# Altium schematic sheet BlockDiagram.SchDoc
size A3; ApprovedBy: Ahmet Can; DocumentNumber: 2; SheetNumber: 2; SheetTotal: 5; ENG_APP_DATE: --/--/--; DSN_APP_DATE: --/--/--; CHK_APP_DATE: --/--/--
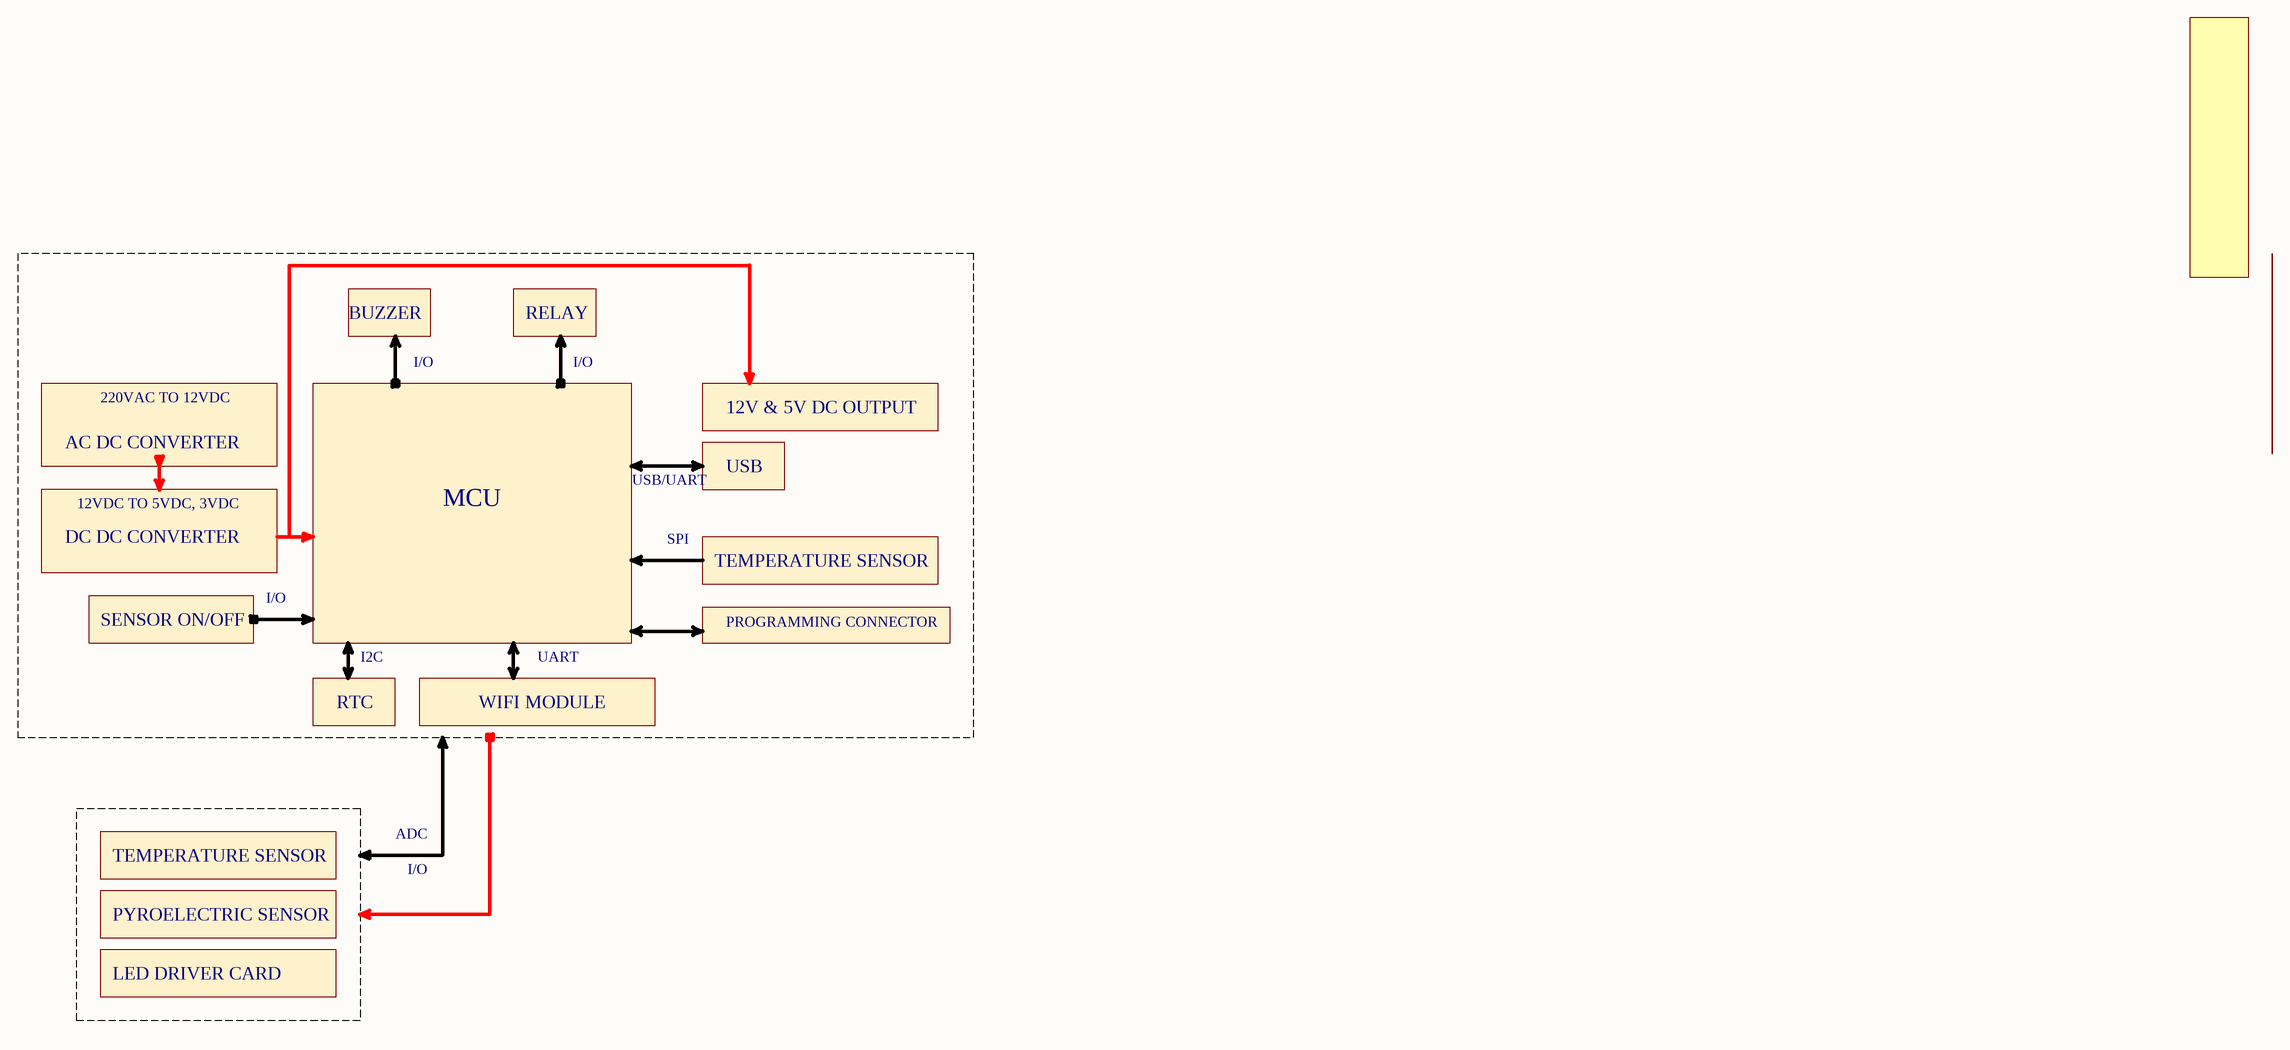
[diagram p0: BlockDiagram.SchDoc]

## Notes on the sheet
- BUZZER
- RELAY
- I/O
- 220VAC TO 12VDC
- 12V & 5V DC OUTPUT
- AC DC CONVERTER
- USB/UART
- USB
- DC DC CONVERTER
- 12VDC TO 5VDC, 3VDC
- MCU
- SPI
- TEMPERATURE SENSOR
- SENSOR ON/OFF
- I2C
- UART
- PROGRAMMING CONNECTOR
- RTC
- WIFI MODULE
- ADC
- HABERLEŞME PROTOKOLLERİ SENKRON VE ASENKRON
  UART
  USART
  i2C
  SPI
- PYROELECTRIC SENSOR
- RESISTORS: RC0603JR-0710KL
  CAPASITORS: C0603C104K4RAC7867
  ALA7DA471CF450
  PCR1E471MCL1GS
- LED DRIVER CARD
- KOMPONENTLER:
  RTC: M41T0M6F
  WIFI MODULE: ESP32-WROOM-32E-N4
  PYRO SENSOR: LHI 878/3902
  TEMPERATURE OUTSIDE: TFPT1206L1002FM
  TEMPERATURE INSIDE: MAX6662MSA+
  MCU: STM32F103C6T6A
  RELAY: ALQ105
  BUZZER: CMI-9605-0580T
  SENSOR ON/OFF: EG1215AA
  AC-DC CONVERTER:
  Bridge Diodes:: DB105S
  Transformeter: BV302S12010
  DC-DC CONVERTER:
  5VDC: LM2675MX-12/NOPB
  3.3VDC: AP7361EA-33E-13
  LED DRIVER MOSFET: SSM3K357R,LF
- Document Name
- Prepared By
- Company Name
- Checked By
- A. Can KARACAN
- Release Date
- Department
- R&D- Hardware
- Size
- Change Date
- A3
- Approved By
- Sheet
- /